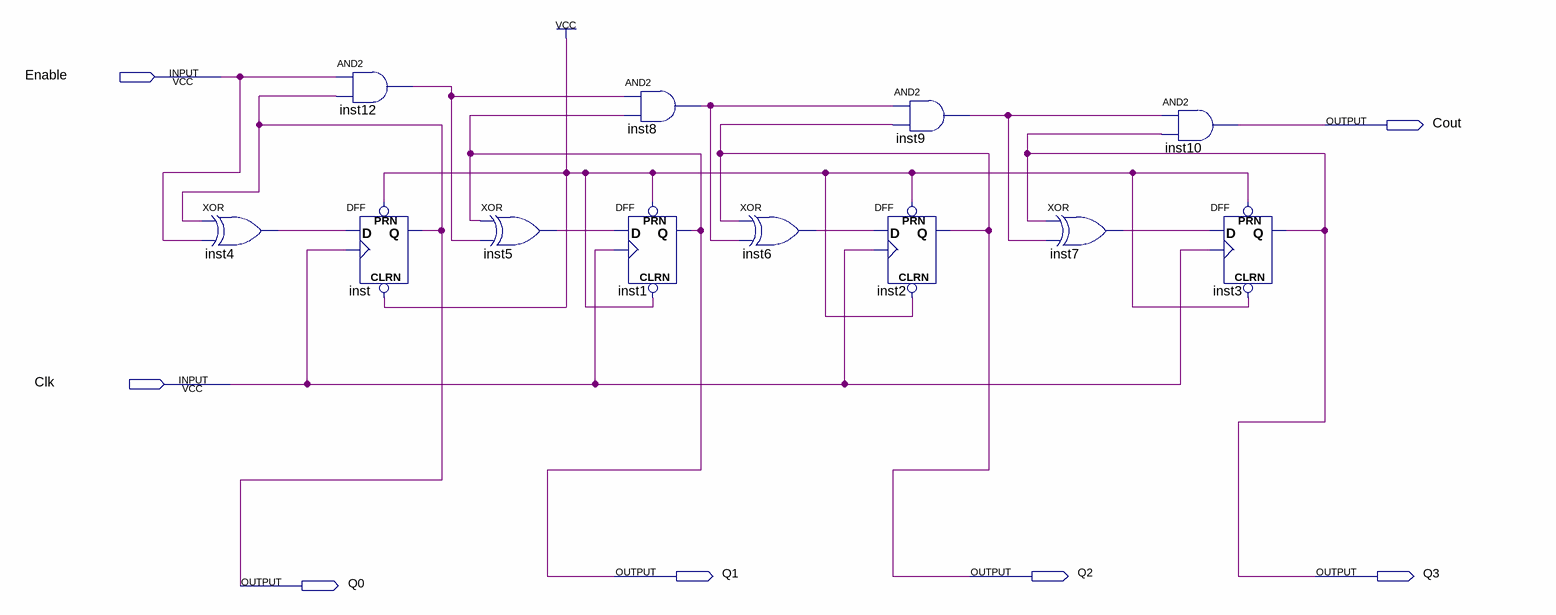
[diagram p0: schematic sheet]
// Quartus schematic Lab10step2a.bdf as structural Verilog: 12 symbols, 7 pins
module Lab10step2a (
  input  Enable,
  input  Clk,
  output Cout,
  output Q1,
  output Q2,
  output Q3,
  output Q0
);

  wire inst4_out, inst5_out, inst6_out, inst7_out, inst8_out, inst9_out, inst12_out;

  xor inst4 (inst4_out, Q0, Enable);
  and inst12 (inst12_out, Enable, Q0);
  DFF inst (.CLRN(1'b1), .CLK(Clk), .D(inst4_out), .PRN(1'b1), .Q(Q0));
  xor inst5 (inst5_out, Q1, inst12_out);
  and inst8 (inst8_out, inst12_out, Q1);
  DFF inst1 (.CLRN(1'b1), .CLK(Clk), .D(inst5_out), .PRN(1'b1), .Q(Q1));
  xor inst6 (inst6_out, Q2, inst8_out);
  and inst9 (inst9_out, inst8_out, Q2);
  DFF inst2 (.CLRN(1'b1), .CLK(Clk), .D(inst6_out), .PRN(1'b1), .Q(Q2));
  xor inst7 (inst7_out, Q3, inst9_out);
  and inst10 (Cout, inst9_out, Q3);
  DFF inst3 (.CLRN(1'b1), .CLK(Clk), .D(inst7_out), .PRN(1'b1), .Q(Q3));
endmodule
